# EAGLE schematic twoBandRepeater (EAGLE 9.4.2)

## Sheet 1 of 6: MCU
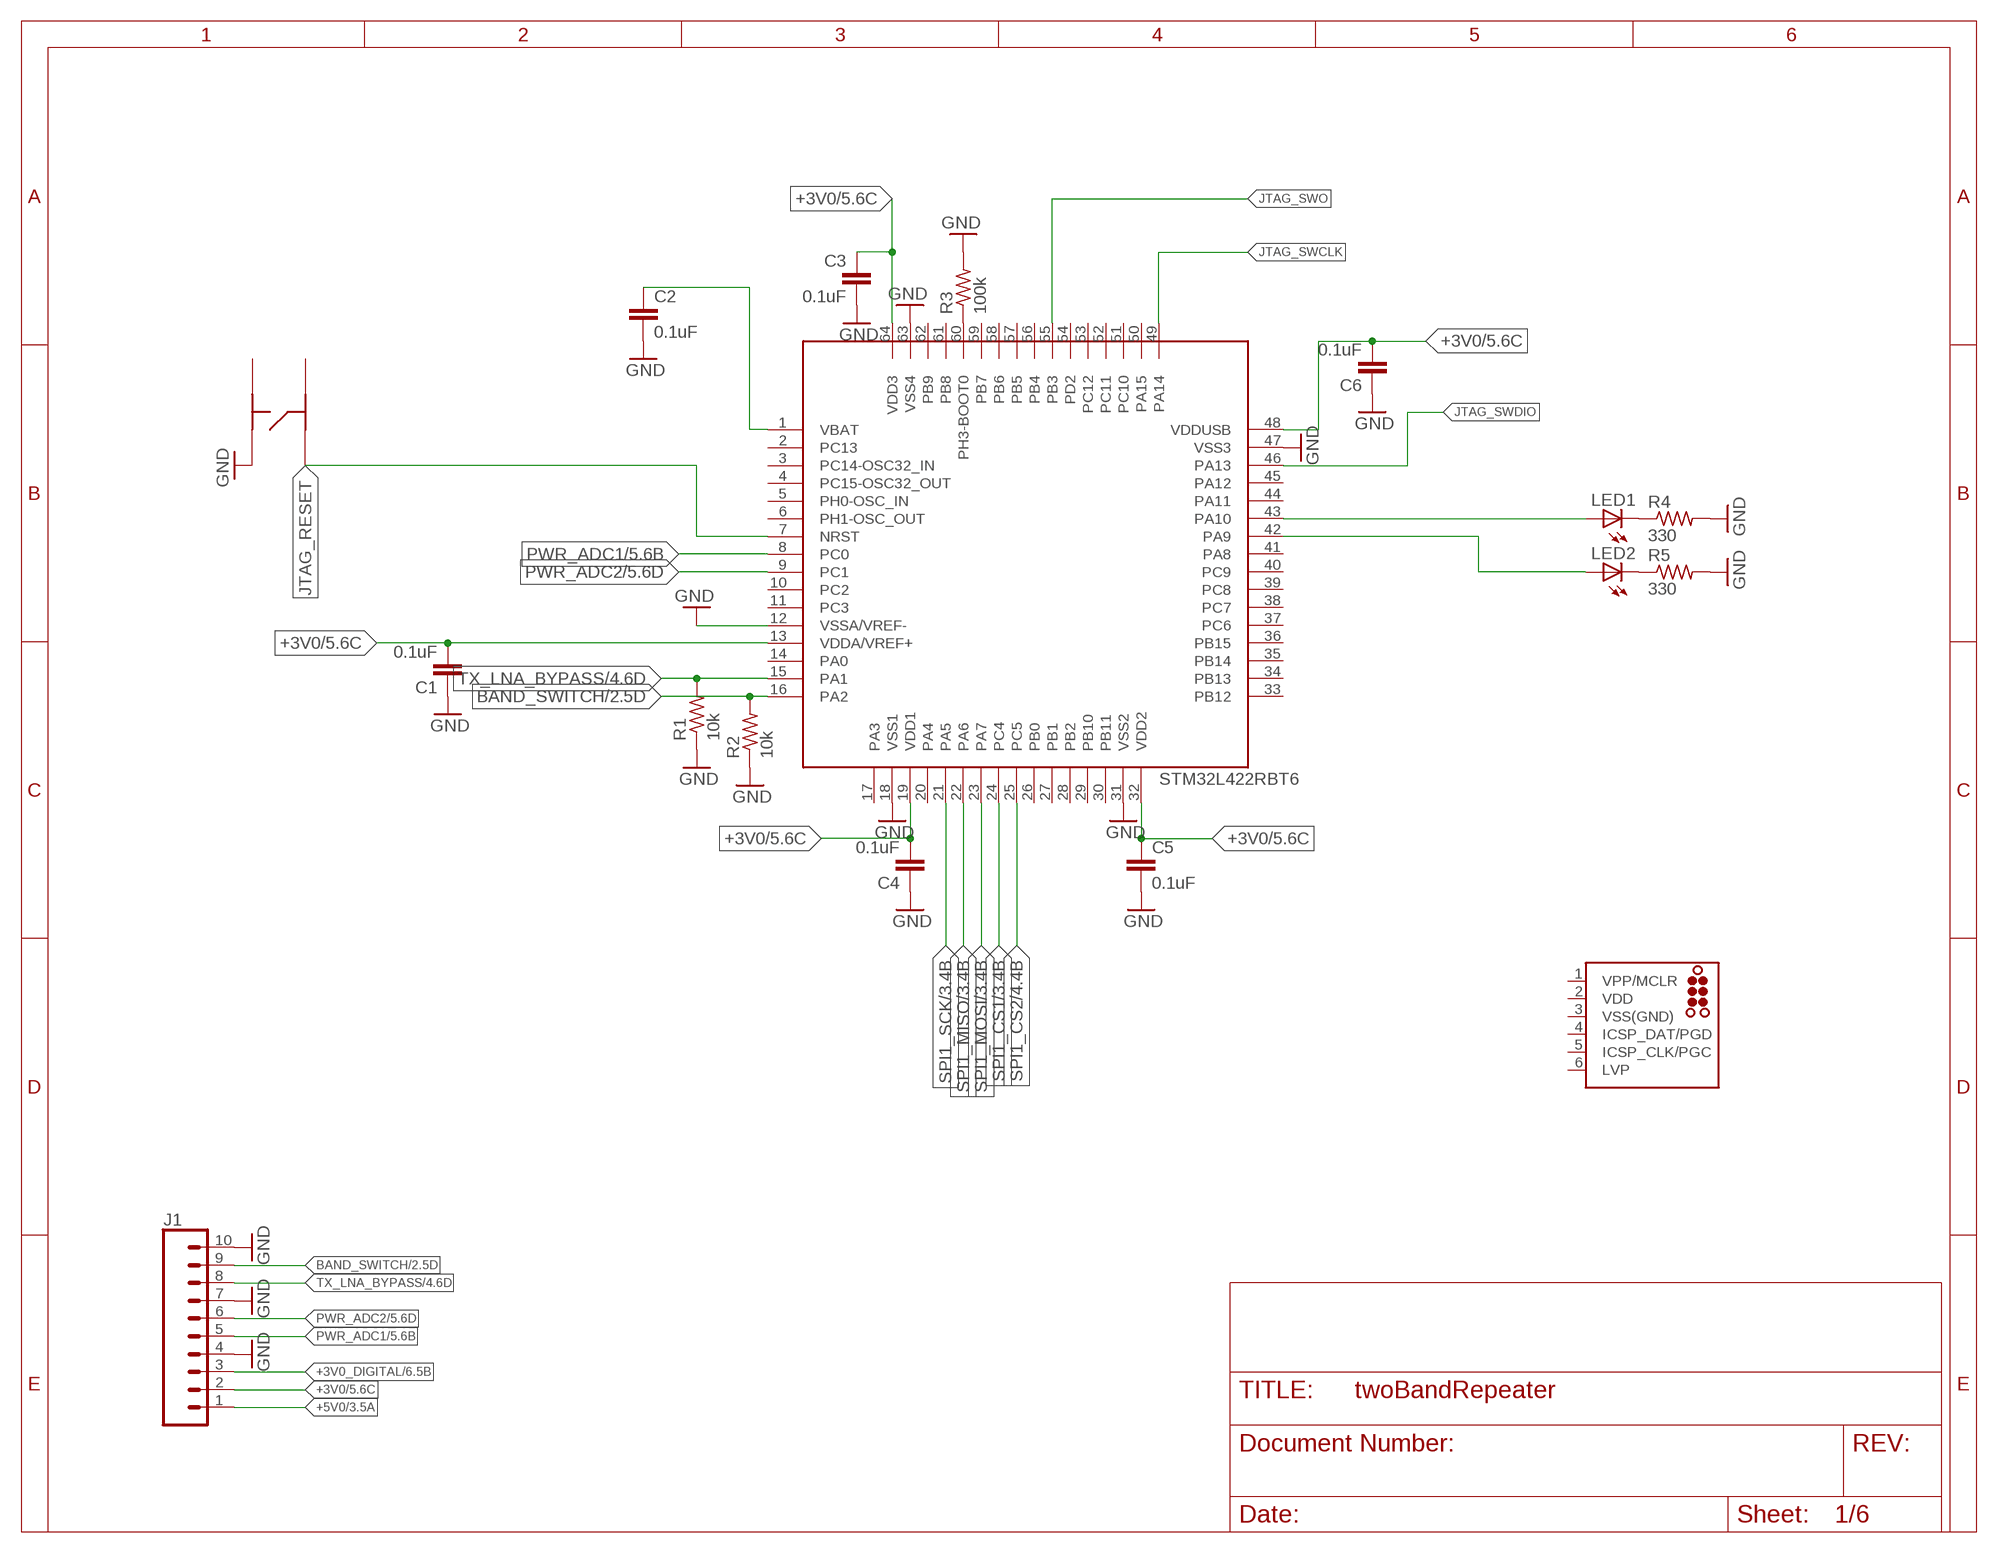
[diagram p0: schematic, sheet 1]

### Parts
C1  0.1uF  C-EUC0402  [C0402]
C2  0.1uF  C-EUC0402  [C0402]
C3  0.1uF  C-EUC0402  [C0402]
C4  0.1uF  C-EUC0402  [C0402]
C5  0.1uF  C-EUC0402  [C0402]
C6  0.1uF  C-EUC0402  [C0402]
J1  CONN_10"  [1X10]
J2  TC2030-MCP  [TC2030-MCP]
LED1  LEDCHIP-LED0603  [CHIP-LED0603]
LED2  LEDCHIP-LED0603  [CHIP-LED0603]
R1  10k  R-US_R0402  [R0402]
R2  10k  R-US_R0402  [R0402]
R3  100k  R-US_R0402  [R0402]
R4  330  R-US_R0402  [R0402]
R5  330  R-US_R0402  [R0402]
S1  KMR731NG  [KMR731NG]
U1  STM32L422RBT6  [QFP50P1200X1200X160-64]

### Nets
+3V0: C1.2 C3.1 C4.2 C5.1 C6.2 J1.2 U1.13(VDDA/VREF+) U1.19(VDD1) U1.32(VDD2) U1.48(VDDUSB) U1.64(VDD3) ; also sheet 5
+3V0_DIGITAL: J1.3 ; also sheet 6
+5V0: J1.1 ; also sheet 3,4,6
BAND_SWITCH: J1.9 R2.2 U1.16(PA2) ; also sheet 2
GND: C1.1 C2.2 C3.2 C4.1 C5.2 C6.1 J1.4 J1.7 J1.10 R1.1 R2.1 R3.2 R4.2 R5.2 S1.P$3 U1.12(VSSA/VREF-) U1.18(VSS1) U1.31(VSS2) U1.47(VSS3) U1.63(VSS4) ; also sheet 2,3,4,5,6
JTAG_RESET: S1.P$2 U1.7(NRST)
JTAG_SWCLK: U1.49(PA14)
JTAG_SWDIO: U1.46(PA13)
JTAG_SWO: U1.55(PB3)
N$16: C2.1 U1.1(VBAT)
N$19: LED1.C R4.1
N$29: LED2.C R5.1
N$35: LED2.A U1.42(PA9)
N$42: LED1.A U1.43(PA10)
N$55: R3.1 U1.60(PH3-BOOT0)
PWR_ADC1: J1.5 U1.8(PC0) ; also sheet 5
PWR_ADC2: J1.6 U1.9(PC1) ; also sheet 5
SPI1_CS1: U1.24(PC4) ; also sheet 3
SPI1_CS2: U1.25(PC5) ; also sheet 4
SPI1_MISO: U1.22(PA6) ; also sheet 3,4
SPI1_MOSI: U1.23(PA7) ; also sheet 3,4
SPI1_SCK: U1.21(PA5) ; also sheet 3,4
TX_LNA_BYPASS: J1.8 R1.2 U1.15(PA1) ; also sheet 4
Unconnected: J2.1(VPP/MCLR) J2.4(ICSP_DAT/PGD) J2.5(ICSP_CLK/PGC) J2.6(LVP) S1.P$1 S1.P$4 U1.2(PC13) U1.3(PC14-OSC32_IN) U1.4(PC15-OSC32_OUT) U1.5(PH0-OSC_IN) U1.6(PH1-OSC_OUT) U1.10(PC2) U1.11(PC3) U1.14(PA0) U1.17(PA3) U1.20(PA4) U1.26(PB0) U1.27(PB1) U1.28(PB2) U1.29(PB10) U1.30(PB11) U1.33(PB12) U1.34(PB13) U1.35(PB14) U1.36(PB15) U1.37(PC6) U1.38(PC7) U1.39(PC8) U1.40(PC9) U1.41(PA8) U1.44(PA11) U1.45(PA12) U1.50(PA15) U1.51(PC10) U1.52(PC11) U1.53(PC12) U1.54(PD2) U1.56(PB4) U1.57(PB5) U1.58(PB6) U1.59(PB7) U1.61(PB8) U1.62(PB9)

## Sheet 2 of 6: Antenna & Duplexer
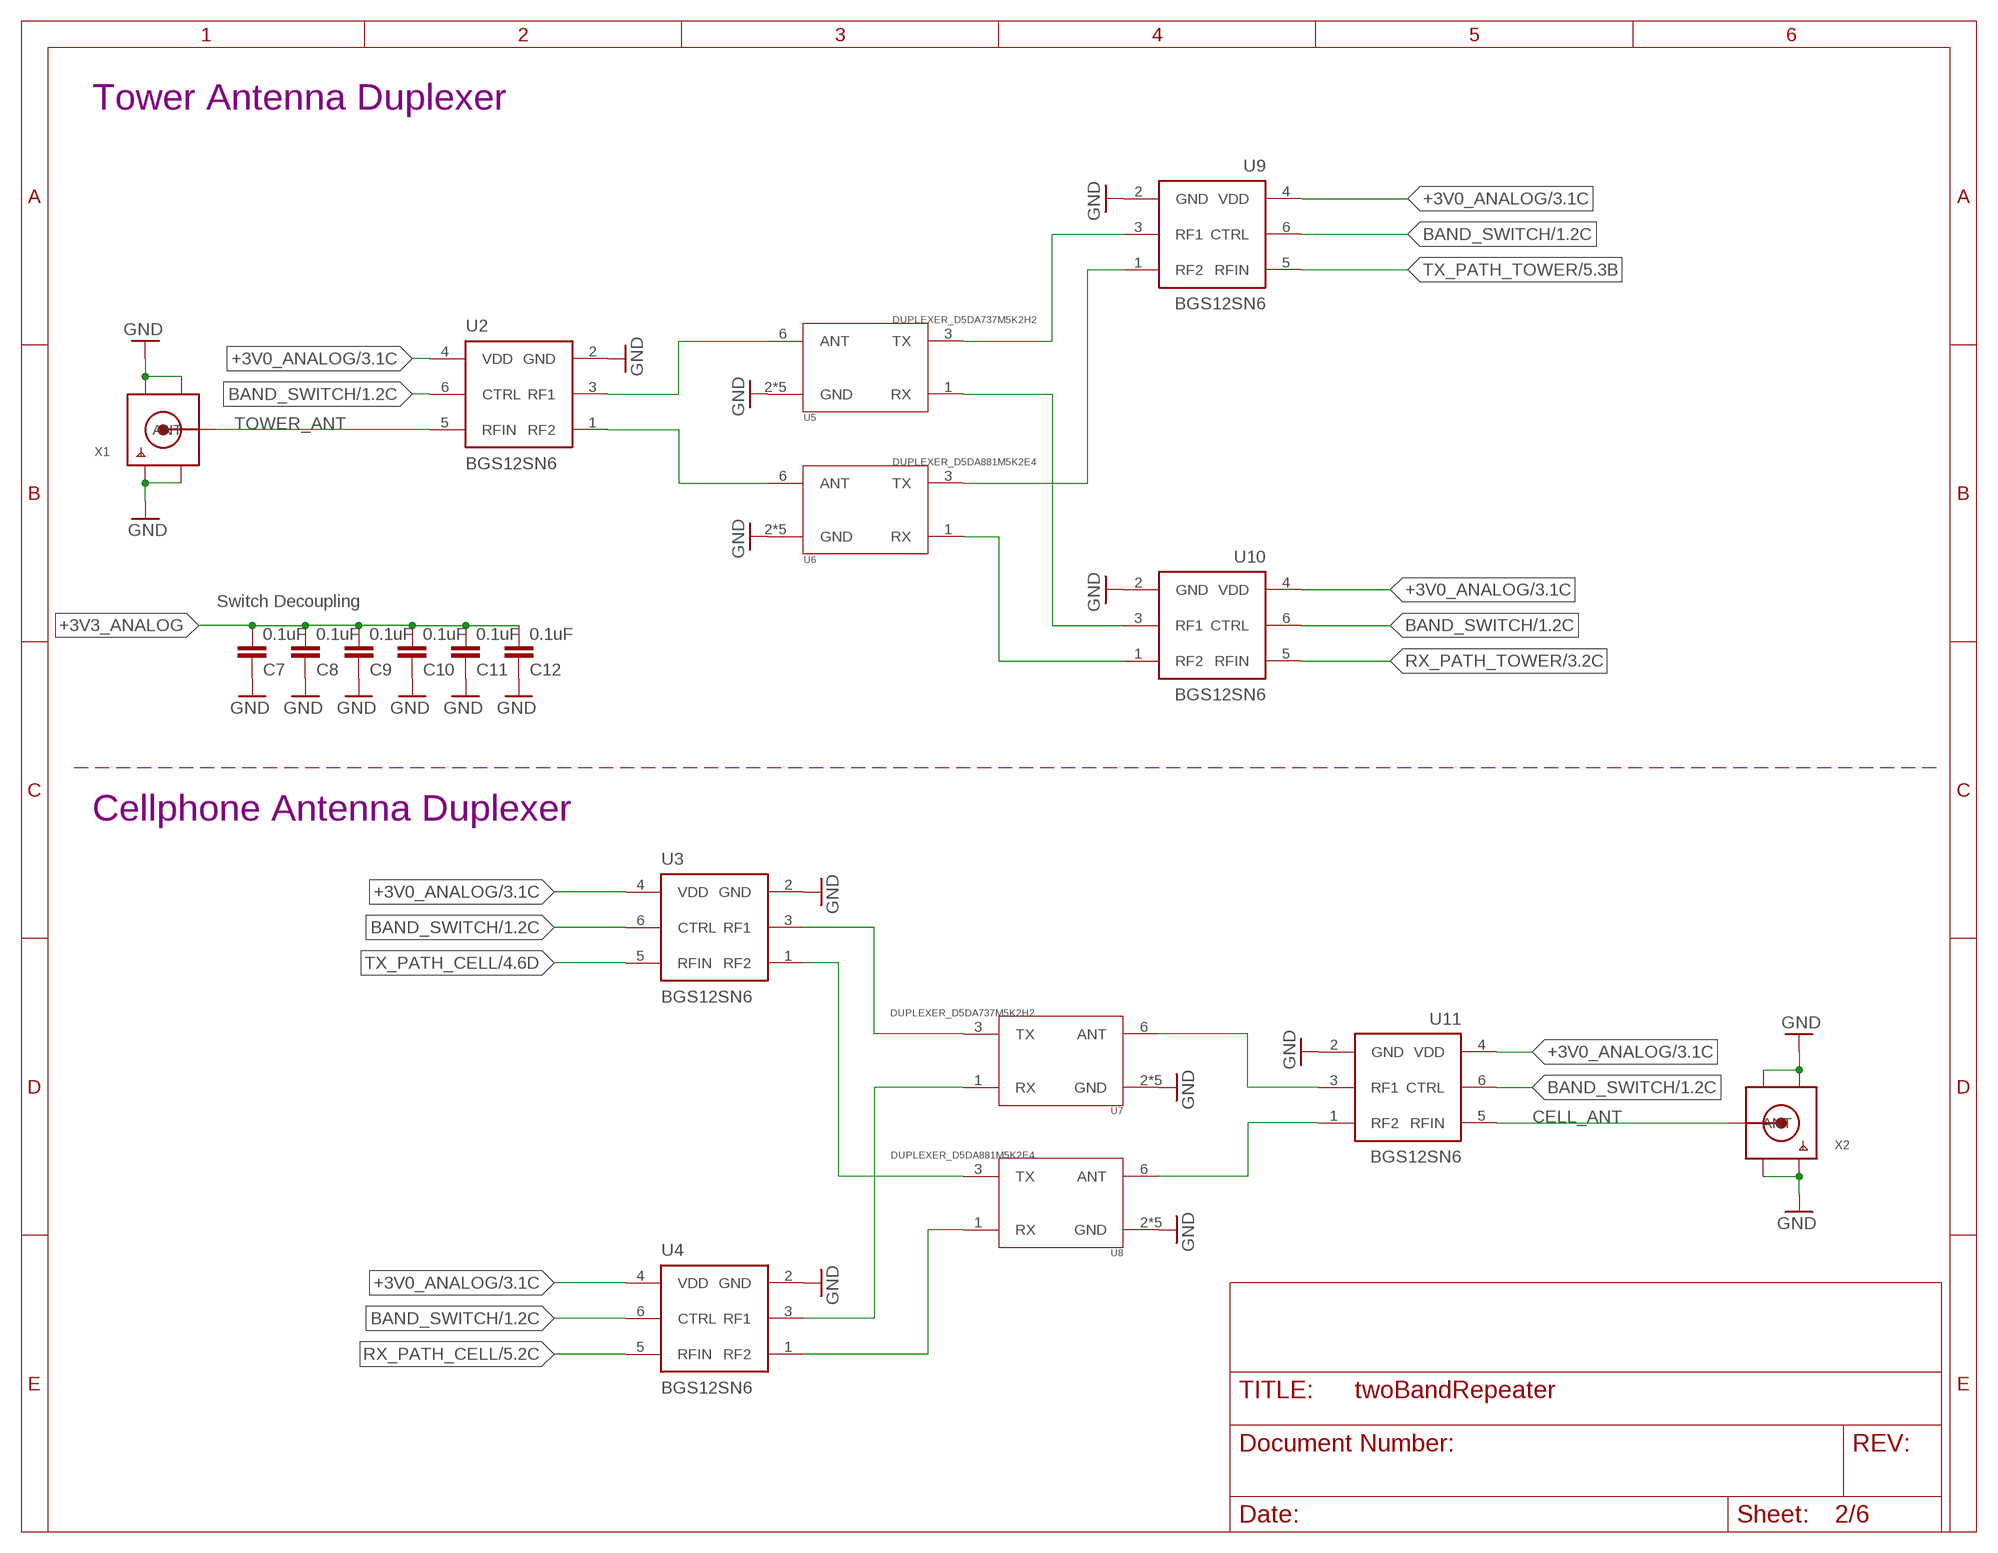
[diagram p1: schematic, sheet 2]

### Parts
C7  0.1uF  C-EUC0402  [C0402]
C8  0.1uF  C-EUC0402  [C0402]
C9  0.1uF  C-EUC0402  [C0402]
C10  0.1uF  C-EUC0402  [C0402]
C11  0.1uF  C-EUC0402  [C0402]
C12  0.1uF  C-EUC0402  [C0402]
U2  BGS12SN6  [INF-PG-TSNP-6-2]
U3  BGS12SN6  [INF-PG-TSNP-6-2]
U4  BGS12SN6  [INF-PG-TSNP-6-2]
U5  DUPLEXER_D5DA737M5K2H2  [TAIYO_YUDEN_DUPLEX_1.8X1.4]
U6  DUPLEXER_D5DA881M5K2E4  [TAIYO_YUDEN_DUPLEX_1.8X1.4]
U7  DUPLEXER_D5DA737M5K2H2  [TAIYO_YUDEN_DUPLEX_1.8X1.4]
U8  DUPLEXER_D5DA881M5K2E4  [TAIYO_YUDEN_DUPLEX_1.8X1.4]
U9  BGS12SN6  [INF-PG-TSNP-6-2]
U10  BGS12SN6  [INF-PG-TSNP-6-2]
U11  BGS12SN6  [INF-PG-TSNP-6-2]
X1  SMACONNECTORSMA_DIP  [SMA_DIP]
X2  SMACONNECTORSMA_DIP  [SMA_DIP]

### Nets
+3V0_ANALOG: U2.4(VDD) U3.4(VDD) U4.4(VDD) U9.4(VDD) U10.4(VDD) U11.4(VDD) ; also sheet 3,4,5,6
+3V3_ANALOG: C7.2 C8.2 C9.2 C10.2 C11.2 C12.2
BAND_SWITCH: U2.6(CTRL) U3.6(CTRL) U4.6(CTRL) U9.6(CTRL) U10.6(CTRL) U11.6(CTRL) ; also sheet 1
CELL_ANT: U11.5(RFIN) X2.ANTENNA(ANT)
GND: C7.1 C8.1 C9.1 C10.1 C11.1 C12.1 U2.2(GND) U3.2(GND) U4.2(GND) U5.2(GND) U5.4(GND) U5.5(GND) U5.7(GND) U5.8(GND) U6.2(GND) U6.4(GND) U6.5(GND) U6.7(GND) U6.8(GND) U7.2(GND) U7.4(GND) U7.5(GND) U7.7(GND) U7.8(GND) U8.2(GND) U8.4(GND) U8.5(GND) U8.7(GND) U8.8(GND) U9.2(GND) U10.2(GND) U11.2(GND) X1.GND1 X1.GND2 X1.GND3 X1.GND4 X2.GND1 X2.GND2 X2.GND3 X2.GND4 ; also sheet 1,3,4,5,6
N$1: U2.3(RF1) U5.6(ANT)
N$2: U2.1(RF2) U6.6(ANT)
N$4: U5.3(TX) U9.3(RF1)
N$5: U6.3(TX) U9.1(RF2)
N$6: U5.1(RX) U10.3(RF1)
N$7: U6.1(RX) U10.1(RF2)
N$12: U7.6(ANT) U11.3(RF1)
N$21: U8.6(ANT) U11.1(RF2)
N$23: U3.3(RF1) U7.3(TX)
N$24: U3.1(RF2) U8.3(TX)
N$25: U4.3(RF1) U7.1(RX)
N$26: U4.1(RF2) U8.1(RX)
RX_PATH_CELL: U4.5(RFIN) ; also sheet 5
RX_PATH_TOWER: U10.5(RFIN) ; also sheet 3
TOWER_ANT: U2.5(RFIN) X1.ANTENNA(ANT)
TX_PATH_CELL: U3.5(RFIN) ; also sheet 4
TX_PATH_TOWER: U9.5(RFIN) ; also sheet 5

### Notes on the sheet
- Tower Antenna Duplexer
- Switch Decoupling
- Cellphone Antenna Duplexer

## Sheet 3 of 6: RX RF Chain
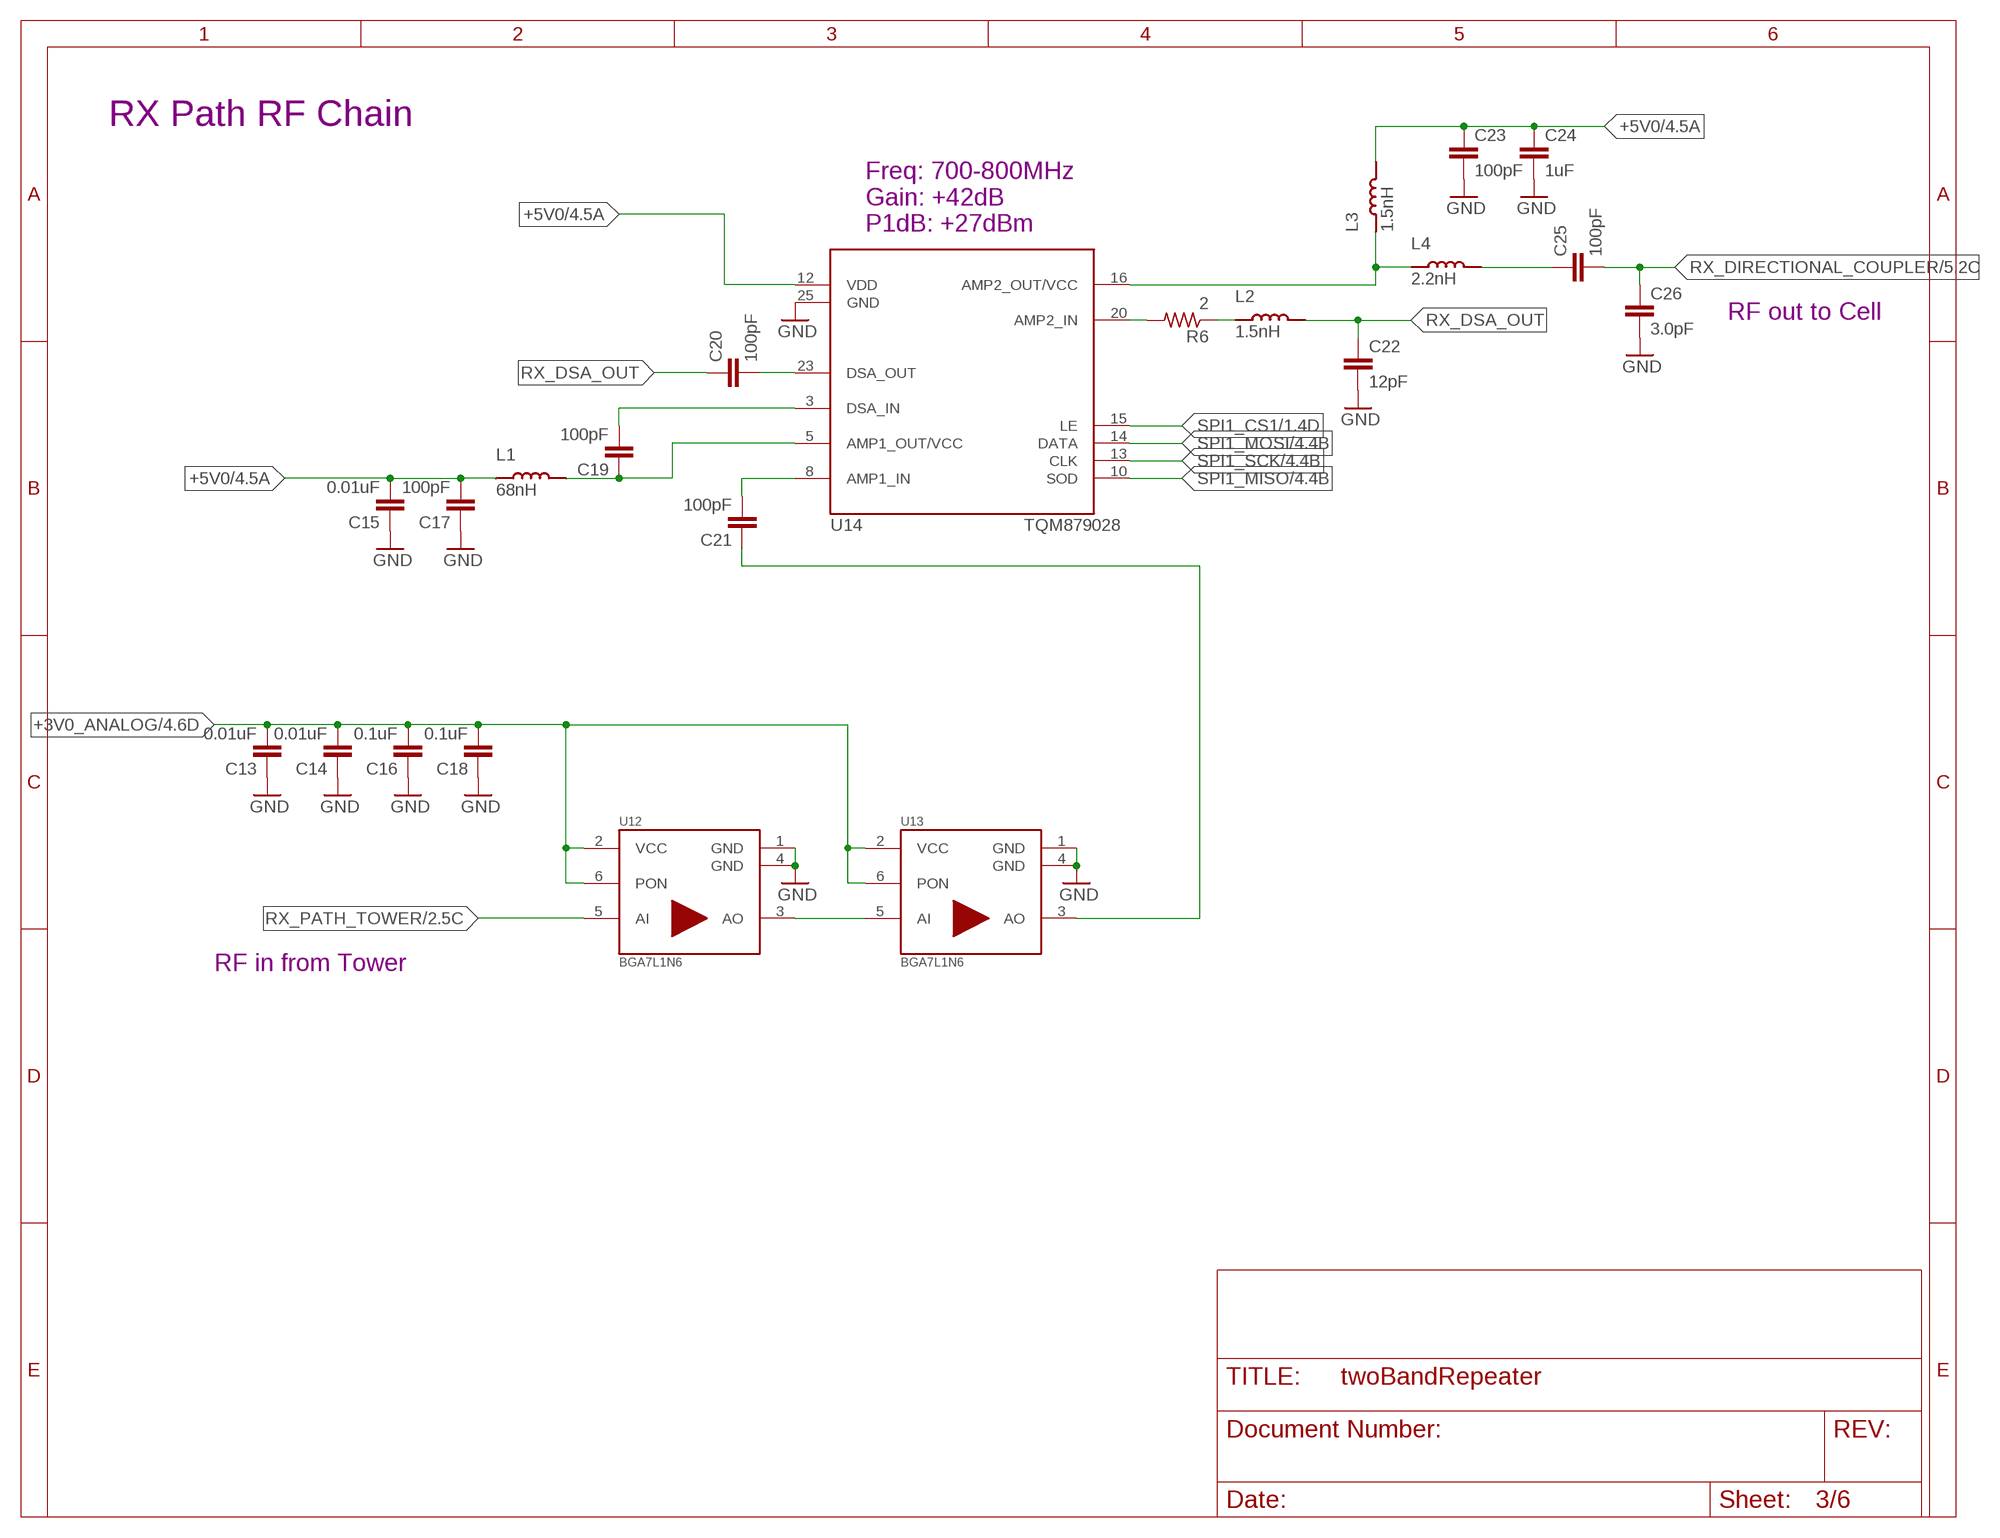
[diagram p2: schematic, sheet 3]

### Parts
C13  0.01uF  C-EUC0402  [C0402]
C14  0.01uF  C-EUC0402  [C0402]
C15  0.01uF  C-EUC0402  [C0402]
C16  0.1uF  C-EUC0402  [C0402]
C17  100pF  C-EUC0402  [C0402]
C18  0.1uF  C-EUC0402  [C0402]
C19  100pF  C-EUC0402  [C0402]
C20  100pF  C-EUC0402  [C0402]
C21  100pF  C-EUC0402  [C0402]
C22  12pF  C-EUC0402  [C0402]
C23  100pF  C-EUC0402  [C0402]
C24  1uF  C-EUC0402  [C0402]
C25  100pF  C-EUC0402  [C0402]
C26  3.0pF  C-EUC0402  [C0402]
L1  68nH  INDUCTOR0402  [0402]
L2  1.5nH  INDUCTOR0402  [0402]
L3  1.5nH  INDUCTOR0402  [0402]
L4  2.2nH  INDUCTOR0402  [0402]
R6  2  R-US_R0402  [R0402]
U12  BGA7L1N6  [INF-PG-TSNP-6-2]
U13  BGA7L1N6  [INF-PG-TSNP-6-2]
U14  TQM879028  [QFN50P400X400X100-25T270N]

### Nets
+3V0_ANALOG: C13.2 C14.2 C16.2 C18.2 U12.2(VCC) U12.6(PON) U13.2(VCC) U13.6(PON) ; also sheet 2,4,5,6
+5V0: C15.2 C17.2 C23.1 C24.1 L1.1 L3.2 U14.12(VDD) ; also sheet 1,4,6
GND: C13.1 C14.1 C15.1 C16.1 C17.1 C18.1 C22.2 C23.2 C24.2 C26.2 U12.1(GND) U12.4(GND) U13.1(GND) U13.4(GND) U14.25(GND) ; also sheet 1,2,4,5,6
N$8: U12.3(AO) U13.5(AI)
N$9: C21.1 U13.3(AO)
N$10: C21.2 U14.8(AMP1_IN)
N$11: C19.1 L1.2 U14.5(AMP1_OUT/VCC)
N$13: C20.2 U14.23(DSA_OUT)
N$14: C19.2 U14.3(DSA_IN)
N$15: L3.1 L4.1 U14.16(AMP2_OUT/VCC)
N$17: L2.1 R6.1
N$18: R6.2 U14.20(AMP2_IN)
N$20: C25.1 L4.2
RX_DIRECTIONAL_COUPLER: C25.2 C26.1 ; also sheet 5
RX_DSA_OUT: C20.1 C22.1 L2.2
RX_PATH_TOWER: U12.5(AI) ; also sheet 2
SPI1_CS1: U14.15(LE) ; also sheet 1
SPI1_MISO: U14.10(SOD) ; also sheet 1,4
SPI1_MOSI: U14.14(DATA) ; also sheet 1,4
SPI1_SCK: U14.13(CLK) ; also sheet 1,4

### Notes on the sheet
- RX Path RF Chain
- Freq: 700-800MHz
  Gain: +42dB
  P1dB: +27dBm
- RF out to Cell
- RF in from Tower

## Sheet 4 of 6: TX RF Chain
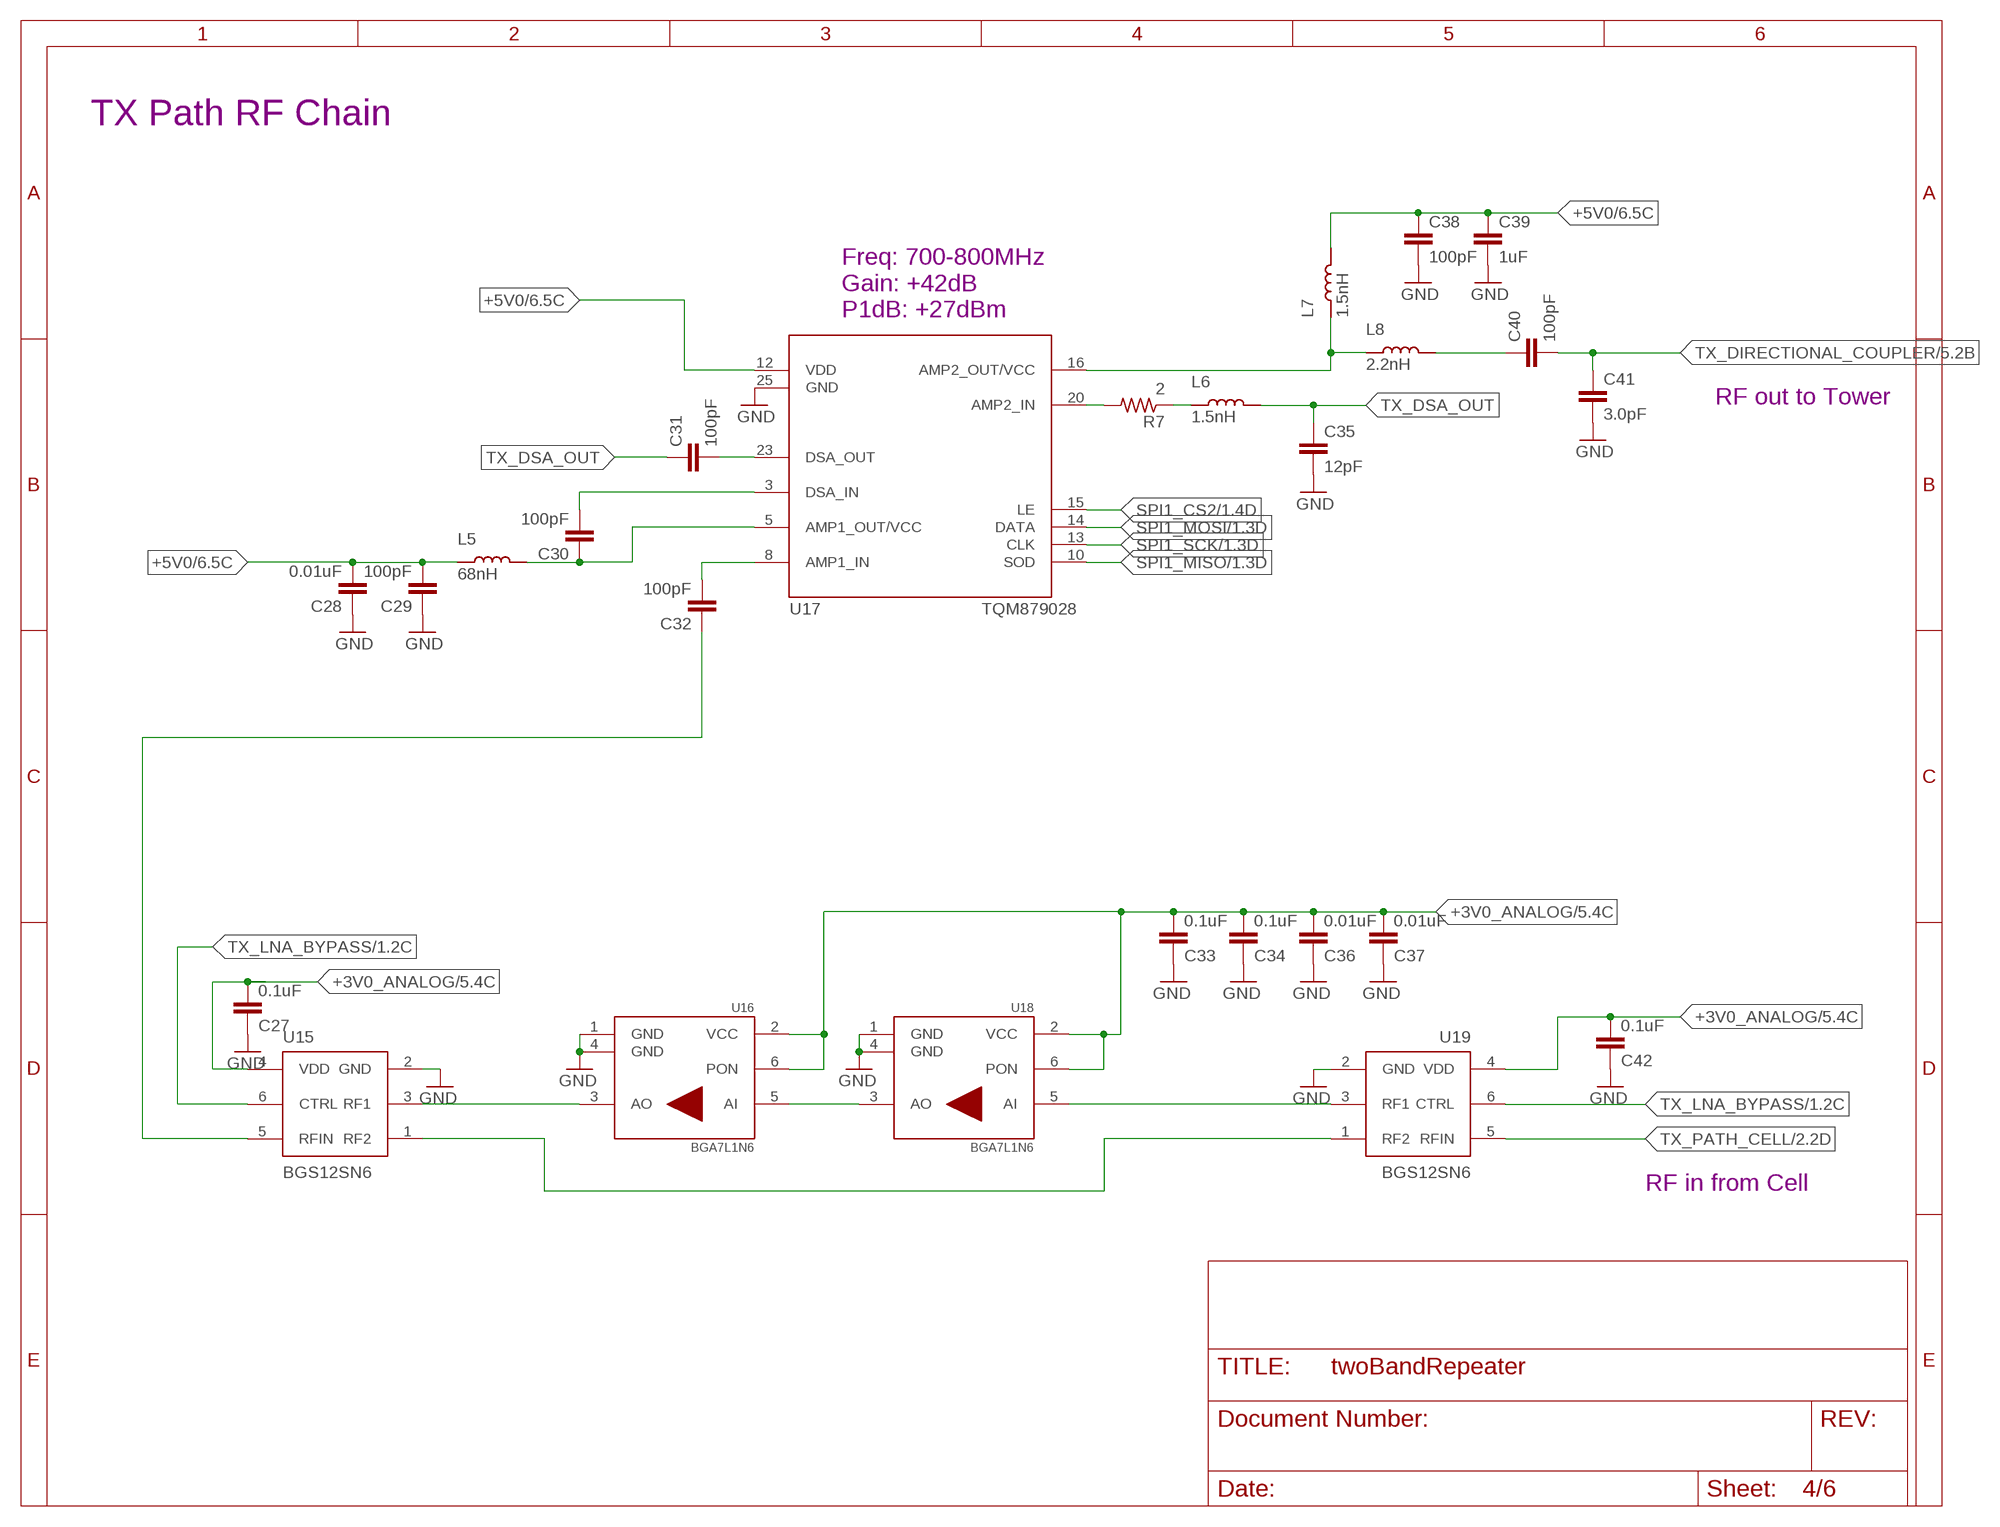
[diagram p3: schematic, sheet 4]

### Parts
C27  0.1uF  C-EUC0402  [C0402]
C28  0.01uF  C-EUC0402  [C0402]
C29  100pF  C-EUC0402  [C0402]
C30  100pF  C-EUC0402  [C0402]
C31  100pF  C-EUC0402  [C0402]
C32  100pF  C-EUC0402  [C0402]
C33  0.1uF  C-EUC0402  [C0402]
C34  0.1uF  C-EUC0402  [C0402]
C35  12pF  C-EUC0402  [C0402]
C36  0.01uF  C-EUC0402  [C0402]
C37  0.01uF  C-EUC0402  [C0402]
C38  100pF  C-EUC0402  [C0402]
C39  1uF  C-EUC0402  [C0402]
C40  100pF  C-EUC0402  [C0402]
C41  3.0pF  C-EUC0402  [C0402]
C42  0.1uF  C-EUC0402  [C0402]
L5  68nH  INDUCTOR0402  [0402]
L6  1.5nH  INDUCTOR0402  [0402]
L7  1.5nH  INDUCTOR0402  [0402]
L8  2.2nH  INDUCTOR0402  [0402]
R7  2  R-US_R0402  [R0402]
U15  BGS12SN6  [INF-PG-TSNP-6-2]
U16  BGA7L1N6  [INF-PG-TSNP-6-2]
U17  TQM879028  [QFN50P400X400X100-25T270N]
U18  BGA7L1N6  [INF-PG-TSNP-6-2]
U19  BGS12SN6  [INF-PG-TSNP-6-2]

### Nets
+3V0_ANALOG: C27.2 C33.2 C34.2 C36.2 C37.2 C42.2 U15.4(VDD) U16.2(VCC) U16.6(PON) U18.2(VCC) U18.6(PON) U19.4(VDD) ; also sheet 2,3,5,6
+5V0: C28.2 C29.2 C38.1 C39.1 L5.1 L7.2 U17.12(VDD) ; also sheet 1,3,6
GND: C27.1 C28.1 C29.1 C33.1 C34.1 C35.2 C36.1 C37.1 C38.2 C39.2 C41.2 C42.1 U15.2(GND) U16.1(GND) U16.4(GND) U17.25(GND) U18.1(GND) U18.4(GND) U19.2(GND) ; also sheet 1,2,3,5,6
N$27: U16.5(AI) U18.3(AO)
N$30: C32.2 U17.8(AMP1_IN)
N$33: C30.1 L5.2 U17.5(AMP1_OUT/VCC)
N$34: C30.2 U17.3(DSA_IN)
N$36: C31.2 U17.23(DSA_OUT)
N$37: L6.1 R7.1
N$38: R7.2 U17.20(AMP2_IN)
N$39: L7.1 L8.1 U17.16(AMP2_OUT/VCC)
N$40: C40.1 L8.2
N$41: U15.3(RF1) U16.3(AO)
N$43: U18.5(AI) U19.3(RF1)
N$44: U15.1(RF2) U19.1(RF2)
N$45: C32.1 U15.5(RFIN)
SPI1_CS2: U17.15(LE) ; also sheet 1
SPI1_MISO: U17.10(SOD) ; also sheet 1,3
SPI1_MOSI: U17.14(DATA) ; also sheet 1,3
SPI1_SCK: U17.13(CLK) ; also sheet 1,3
TX_DIRECTIONAL_COUPLER: C40.2 C41.1 ; also sheet 5
TX_DSA_OUT: C31.1 C35.1 L6.2
TX_LNA_BYPASS: U15.6(CTRL) U19.6(CTRL) ; also sheet 1
TX_PATH_CELL: U19.5(RFIN) ; also sheet 2

### Notes on the sheet
- TX Path RF Chain
- Freq: 700-800MHz
  Gain: +42dB
  P1dB: +27dBm
- RF out to Tower
- RF in from Cell

## Sheet 5 of 6: RF Power Meter
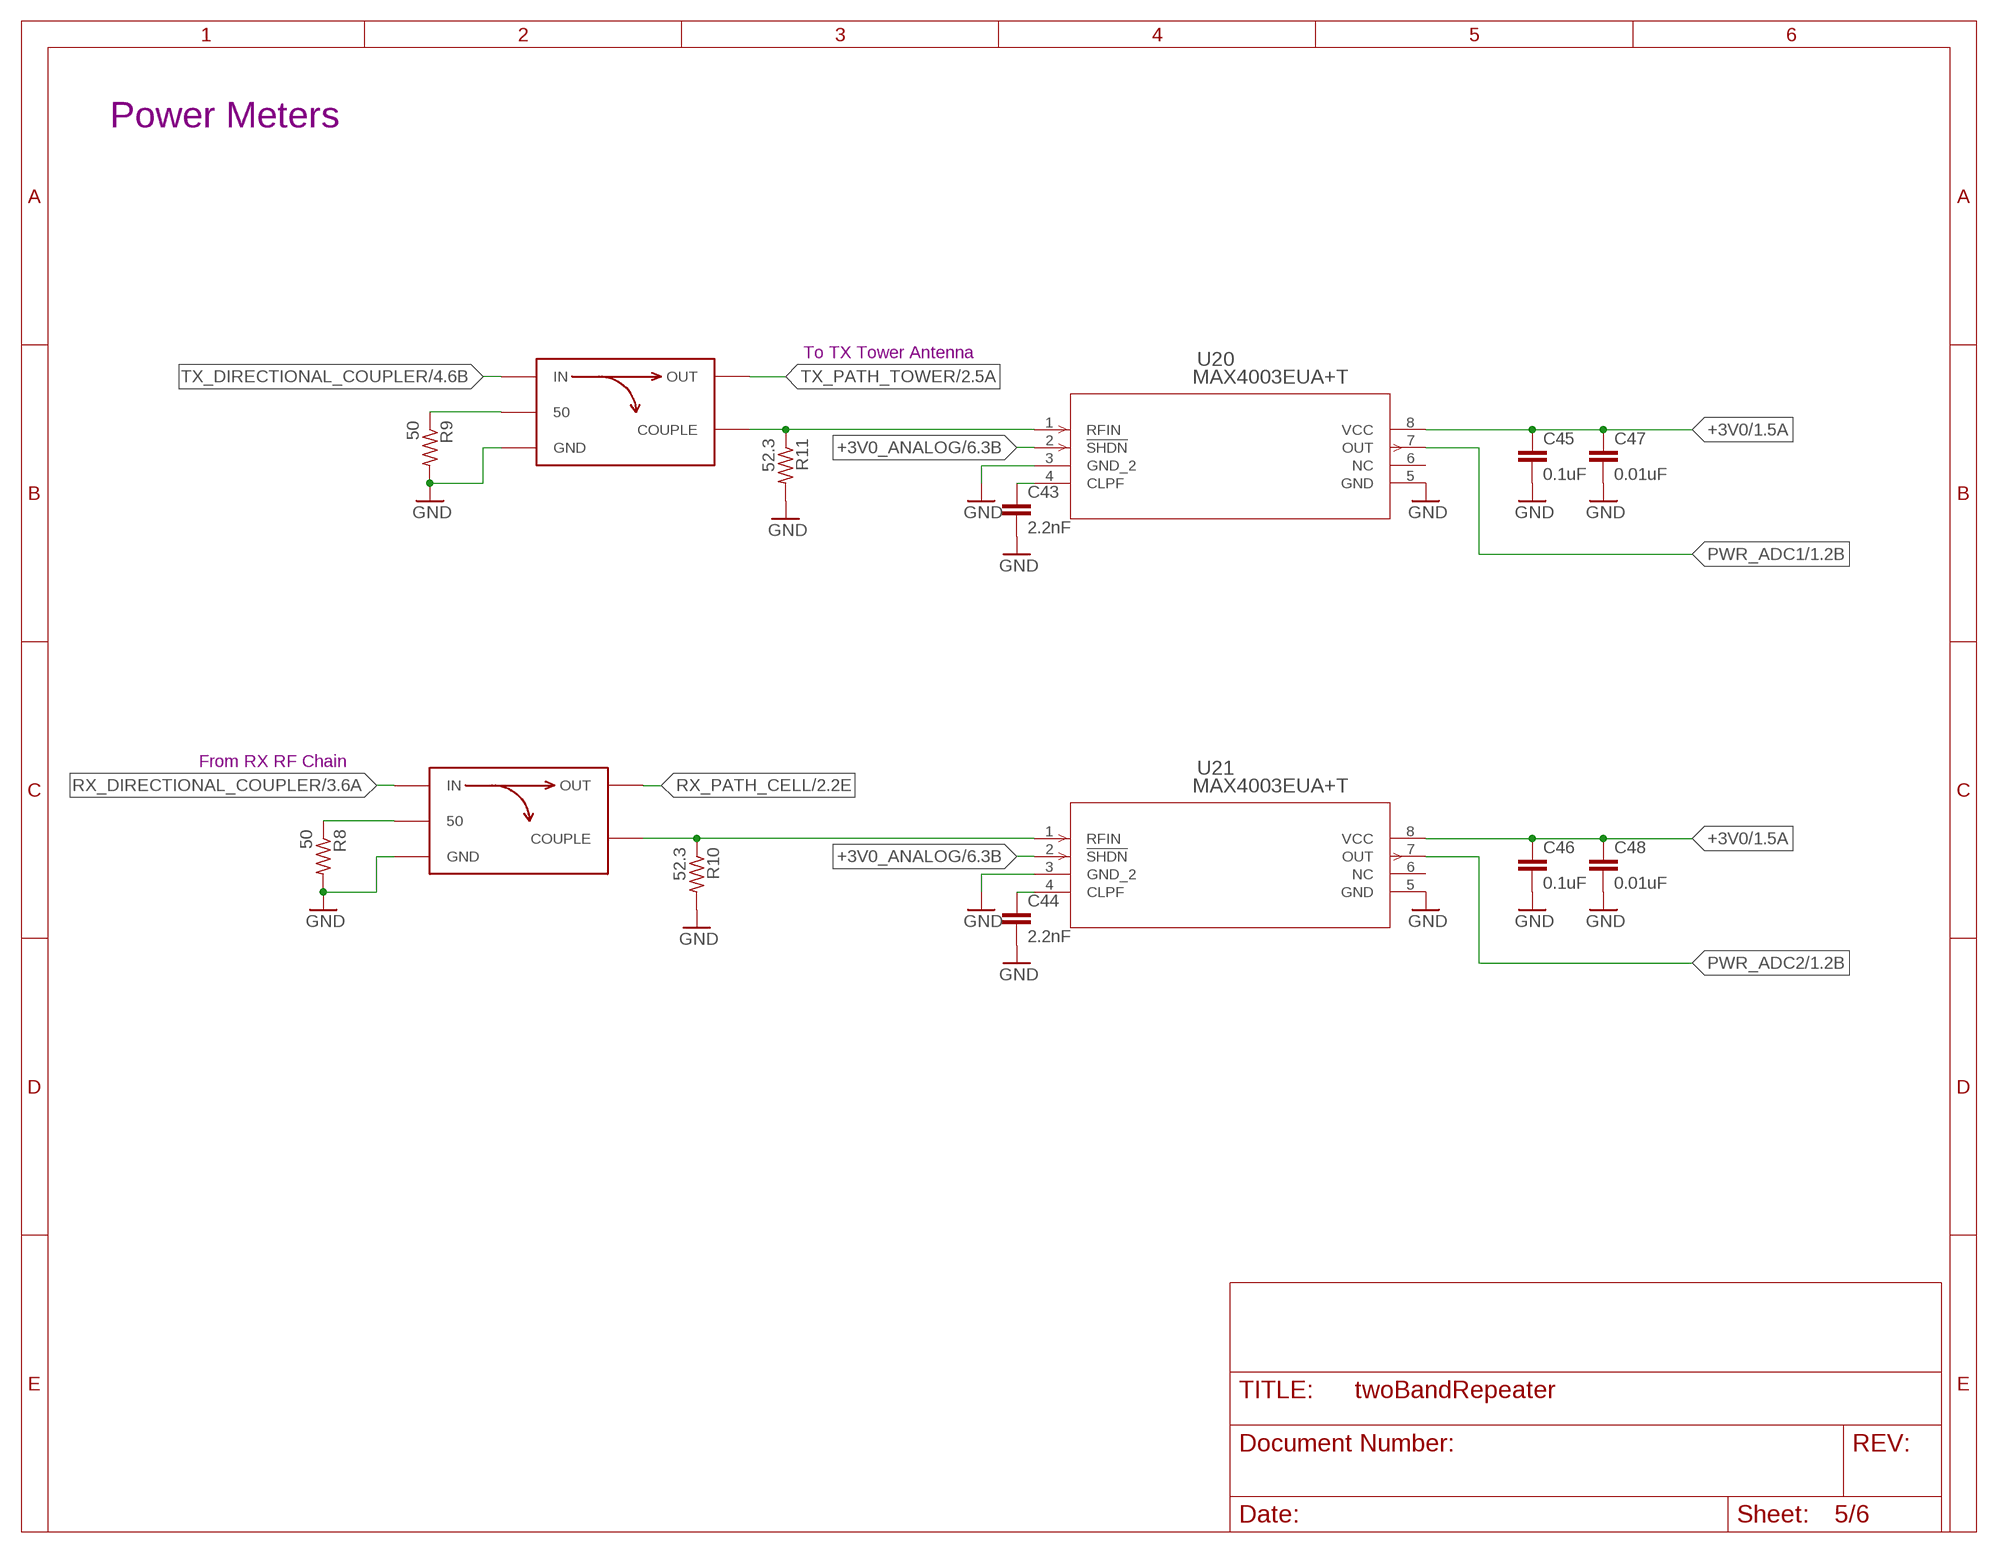
[diagram p4: schematic, sheet 5]

### Parts
C43  2.2nF  C-EUC0402  [C0402]
C44  2.2nF  C-EUC0402  [C0402]
C45  0.1uF  C-EUC0402  [C0402]
C46  0.1uF  C-EUC0402  [C0402]
C47  0.01uF  C-EUC0402  [C0402]
C48  0.01uF  C-EUC0402  [C0402]
HY1  HHM22152A2  [HHM22152A2]
HY2  HHM22152A2  [HHM22152A2]
R8  50  R-US_R0402  [R0402]
R9  50  R-US_R0402  [R0402]
R10  52.3  R-US_R0402  [R0402]
R11  52.3  R-US_R0402  [R0402]
U20  MAX4003EUA+T  [21-0036K]
U21  MAX4003EUA+T  [21-0036K]

### Nets
+3V0: C45.1 C46.1 C47.1 C48.1 U20.8(VCC) U21.8(VCC) ; also sheet 1
+3V0_ANALOG: U20.2(!SHDN) U21.2(!SHDN) ; also sheet 2,3,4,6
GND: C43.2 C44.2 C45.2 C46.2 C47.2 C48.2 HY1.P$2(GND) HY1.P$5(GND) HY2.P$2(GND) HY2.P$5(GND) R8.2 R9.2 R10.2 R11.2 U20.3(GND_2) U20.5(GND) U21.3(GND_2) U21.5(GND) ; also sheet 1,2,3,4,6
N$28: HY2.P$4 R9.1
N$46: C43.1 U20.4(CLPF)
N$47: HY2.P$6(COUPLE) R11.1 U20.1(RFIN)
N$48: HY1.P$4 R8.1
N$49: C44.1 U21.4(CLPF)
N$50: HY1.P$6(COUPLE) R10.1 U21.1(RFIN)
PWR_ADC1: U20.7(OUT) ; also sheet 1
PWR_ADC2: U21.7(OUT) ; also sheet 1
RX_DIRECTIONAL_COUPLER: HY1.P$1(IN) ; also sheet 3
RX_PATH_CELL: HY1.P$3(OUT) ; also sheet 2
TX_DIRECTIONAL_COUPLER: HY2.P$1(IN) ; also sheet 4
TX_PATH_TOWER: HY2.P$3(OUT) ; also sheet 2
Unconnected: U20.6(NC) U21.6(NC)

### Notes on the sheet
- Power Meters
- To TX Tower Antenna
- From RX RF Chain

## Sheet 6 of 6: Power
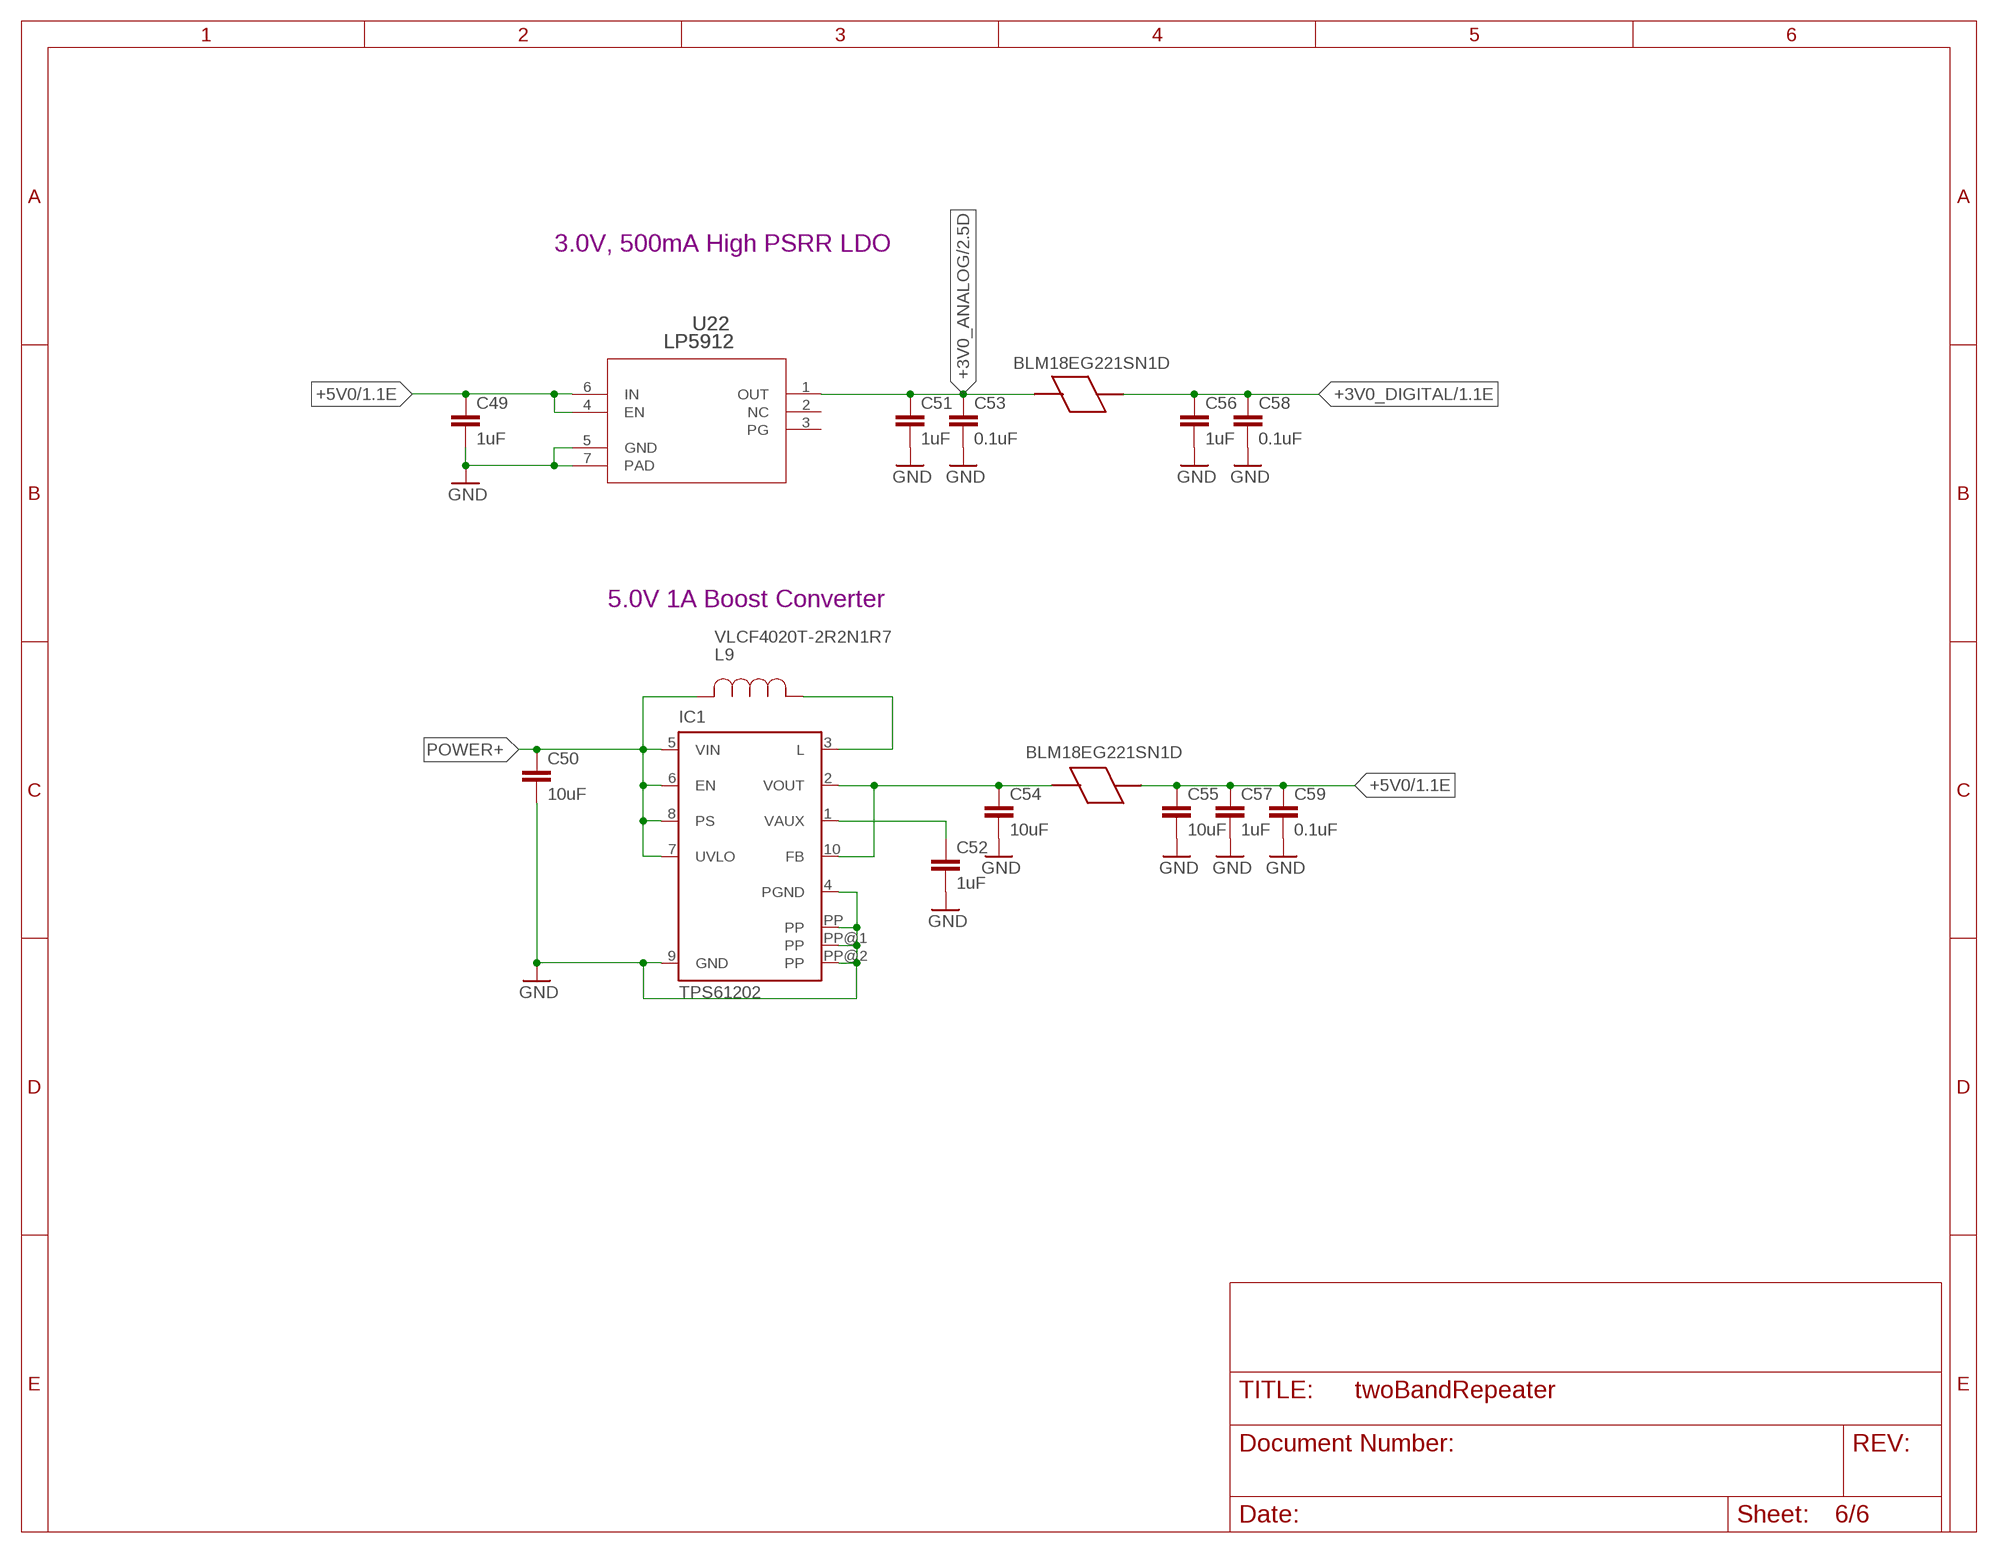
[diagram p5: schematic, sheet 6]

### Parts
C49  1uF  C-EUC0402  [C0402]
C50  10uF  C-EUC0805  [C0805]
C51  1uF  C-EUC0402  [C0402]
C52  1uF  C-EUC0402  [C0402]
C53  0.1uF  C-EUC0402  [C0402]
C54  10uF  C-EUC0805  [C0805]
C55  10uF  C-EUC0805  [C0805]
C56  1uF  C-EUC0402  [C0402]
C57  1uF  C-EUC0402  [C0402]
C58  0.1uF  C-EUC0402  [C0402]
C59  0.1uF  C-EUC0402  [C0402]
IC1  TPS61202  [S-PDSO-N10]
L9  VLCF4020T-2R2N1R7  [IND_4028]
L10  BLM18EG221SN1D  [IND_BLM18_0603]
L11  BLM18EG221SN1D  [IND_BLM18_0603]
U22  LP5912  [DRV0006A]

### Nets
+3V0_ANALOG: C51.1 C53.1 L10.1 U22.1(OUT) ; also sheet 2,3,4,5
+3V0_DIGITAL: C56.1 C58.1 L10.2 ; also sheet 1
+5V0: C49.1 C55.1 C57.1 C59.1 L11.2 U22.4(EN) U22.6(IN) ; also sheet 1,3,4
GND: C49.2 C50.2 C51.2 C52.2 C53.2 C54.2 C55.2 C56.2 C57.2 C58.2 C59.2 IC1.4(PGND) IC1.9(GND) IC1.PP IC1.PP@1(PP) IC1.PP@2(PP) U22.5(GND) U22.7(PAD) ; also sheet 1,2,3,4,5
N$31: IC1.3(L) L9.1
N$51: C54.1 IC1.2(VOUT) IC1.10(FB) L11.1
N$53: C52.1 IC1.1(VAUX)
POWER+: C50.1 IC1.5(VIN) IC1.6(EN) IC1.7(UVLO) IC1.8(PS) L9.2
Unconnected: U22.2(NC) U22.3(PG)

### Notes on the sheet
- 3.0V, 500mA High PSRR LDO
- 5.0V 1A Boost Converter

## Power pins joined to a net without a drawn wire
VDD: J2.2(VDD)
VSS(GND): J2.3(VSS(GND))

## Library data of the parts
C1-C59 = rcl:C-EU: CAPACITOR, European symbol; SPICEPREFIX: C
HY1 HY2 = Charles:HHM22152A2: RF DIR COUPLER 450-3800MHZ 1608
IC1 = texas:TPS6120*: LOW INPUT VOLTAGE SYNCHRONOUS BOOST CONVERTER WITH 1.3-A SWITCHES Source: http://focus.ti.com/lit/ds/symlink/tps61200.pdf; MPN: TPS61202DRCR; OC_FARNELL: unknown; OC_NEWARK: 37M0069
J1 = SparkFun-Connectors:CONN_10: Multi connection point. Often used as Generic Header-pin footprint for 0.1 inch spaced/style header connections On any of the 0.1 inch spaced packages, you can populate with these: Break Away Headers - Straight <https://www.sparkfun.com/products/116> (PRT-00116) Break Away Male Headers - Right Angle <https://www.sparkfun.com/products/553> (PRT-00553) Female Headers <https://www.sparkfun.com/products/115> (PRT-00115) Break Away Headers - Machine Pin <https://www.sparkfun.com/products/117> (PRT-00117) Break Away Female Headers - Swiss Machine Pin <https://www.sparkfun.com/products/743> (PRT-00743) Arduino Stackable Header - 10 Pin <https://www.sparkfun.com/products/11376> (PRT-11376) For SCREWTERMINALS and SPRING TERMINALS visit here: Screw Terimnals on SparkFun.com <https://www.sparkfun.com/search/results?term=Screw+Terminals> (5mm/3.5mm/2.54mm spacing) This device is also useful as a general connection point to wire up your design to another part of your project. Our various solder wires solder well into these plated through hole pads. Hook-Up Wire - Assortment (Stranded, 22 AWG) <https://www.sparkfun.com/products/11375> (PRT-11375) Hook-Up Wire - Assortment (Solid Core, 22 AWG) <https://www.sparkfun.com/products/11367> (PRT-11367) View the entire wire category on our website here <https://www.sparkfun.com/categories/141> Special notes: Molex polarized connector foot print use with SKU : PRT-08231 with associated crimp pins and housings. 1MM SMD Version SKU: PRT-10208 NOTES ON THE VARIANTS LOCK and LOCK_LONGPADS... This footprint was designed to help hold the alignment of a through-hole component (i.e. 6-pin header) while soldering it into place. You may notice that each hole has been shifted either up or down by 0.005 of an inch from it's more standard position (which is a perfectly straight line). This slight alteration caused the pins (the squares in the middle) to touch the edges of the holes. Because they are alternating, it causes a "brace" to hold the component in place. 0.005 has proven to be the perfect amount of "off-center" position when using our standard breakaway headers. Although looks a little odd when you look at the bare footprint, once you have a header in there, the alteration is very hard to notice. Also,if you push a header all the way into place, it is covered up entirely on the bottom side.; PROD_ID: CONN-11563
J2 = Tag-Connect-Footprints:TC2030: TAG-CONNECT ICSP Connector Manufacturer: Tag-Connect <http://www.tag-connect.com> Cable for easy In-Circuit Serial Programming. Designed for Microchip ICD2, suitable for many others. Two variants - one "with legs" (for hands-free fit on PCB) and another "without legs" for quick programming. PAD Description 1 MCLR/Vpp 2 Vdd 3 GND 4 PGD (ISPDAT) 5 PGC (ISPCLK) 6 nc (used for LVP) ©2009 ROFA.cz - modified and updated by Robert Darlington ‹rdarlington@gmail.com›
L1-L8 = Charles:INDUCTOR: Chip Inductor
L9 = Charles:VLCF4020T-2R2N1R7: FIXED IND 2.2UH 1.72A 59 MOHM
L10 L11 = Charles:BLM18EG221SN1D: Ferrite Bead; COPYRIGHT: Copyright C 2015 Accelerated Designs. All rights reserved; MANUFACTURER_PART_NUMBER: BLM18EG221SN1D; VENDOR: MURATA
LED1 LED2 = adafruit:LED: LED OSRAM: - CHIPLED LG R971, LG N971, LY N971, LG Q971, LY Q971, LO R971, LY R971 LH N974, LH R974 LS Q976, LO Q976, LY Q976 LO Q996 - Hyper CHIPLED LW Q18S LB Q993, LB Q99A, LB R99A - SideLED LS A670, LO A670, LY A670, LG A670, LP A670 LB A673, LV A673, LT A673, LW A673 LH A674 LY A675 LS A676, LA A676, LO A676, LY A676, LW A676 LS A679, LY A679, LG A679 - Hyper Micro SIDELED® LS Y876, LA Y876, LO Y876, LY Y876 LT Y87S - SmartLED LW L88C, LW L88S LB L89C, LB L89S, LG L890 LS L89K, LO L89K, LY L89K LS L896, LA L896, LO L896, LY L896 - TOPLED LS T670, LO T670, LY T670, LG T670, LP T670 LSG T670, LSP T670, LSY T670, LOP T670, LYG T670 LG T671, LOG T671, LSG T671 LB T673, LV T673, LT T673, LW T673 LH T674 LS T676, LA T676, LO T676, LY T676, LB T676, LH T676, LSB T676, LW T676 LB T67C, LV T67C, LT T67C, LS T67K, LO T67K, LY T67K, LW E67C LS E67B, LA E67B, LO E67B, LY E67B, LB E67C, LV E67C, LT E67C LW T67C LS T679, LY T679, LG T679 LS T770, LO T770, LY T770, LG T770, LP T770 LB T773, LV T773, LT T773, LW T773 LH T774 LS E675, LA E675, LY E675, LS T675 LS T776, LA T776, LO T776, LY T776, LB T776 LHGB T686 LT T68C, LB T68C - Hyper Mini TOPLED® LB M676 - Mini TOPLED Santana® LG M470 LS M47K, LO M47K, LY M47K Source: http://www.osram.convergy.de/
R1-R11 = rcl:R-US_: RESISTOR, American symbol; SPICEPREFIX: R
S1 = Charles:KMR731NG: Tactile Switch SPST-NO Top Actuated Surface Mount
U1 = Charles:STM32L422RBT6: Ultra-low-power Arm® Cortex®-M4 32-bit MCU+FPU, 100DMIPS, 128KB Flash, 40KB SRAM, analog, AES
U2-U4 U9-U11 U15 U19 = BGS12SN6:BGS12SN6: BGS12SN6 Wideband RF SPDT Switch INF-PG-TSNP-6-2
U5 U7 = Charles:DUPLEXER_: Taiyo Yuden SAW Duplexer for Mobile Communications; BAND: 12; FREQ: 699-746MHz
U6 U8 = Charles:DUPLEXER_: Taiyo Yuden SAW Duplexer for Mobile Communications; BAND: 5; FREQ: 824-849MHz
U12 U13 U16 U18 = BGA7L1N6:BGA7L1N6: BGA7L1N6 Silicon Germanium Low Noise Amplifier for LTE, Insertion Power Gain:13.3dB INF-PG-TSNP-6-2
U14 U17 = Charles:TQM879028: Qorvo 0.6-4 GHz 1/2 W Digital Variable Gain Amplifier. Variable gain from 0.5 dB to 32 dB at 2.14 GHz, +44 dBm output IP3, and +27.5 dBm P1dB, 230 mA current from a 5V supply.
U20 U21 = Charles:MAX4003EUA+T; BUILT_BY: EMA_UL_Team; MANUFACTURER_PART_NUMBER: max4003eua+T; VENDOR: Maxim Integrated Products
U22 = Charles:LP5912: 500-mA Low-Noise, Low-IQ LDO, High PSRR
X1 X2 = Charles:SMACONNECTOR: SMA Connector DIP SMA Connector, 50 Ohm (4UConnector: 07259)